# Altium schematic sheet power_5V_3V3_V10.SchDoc
size A4
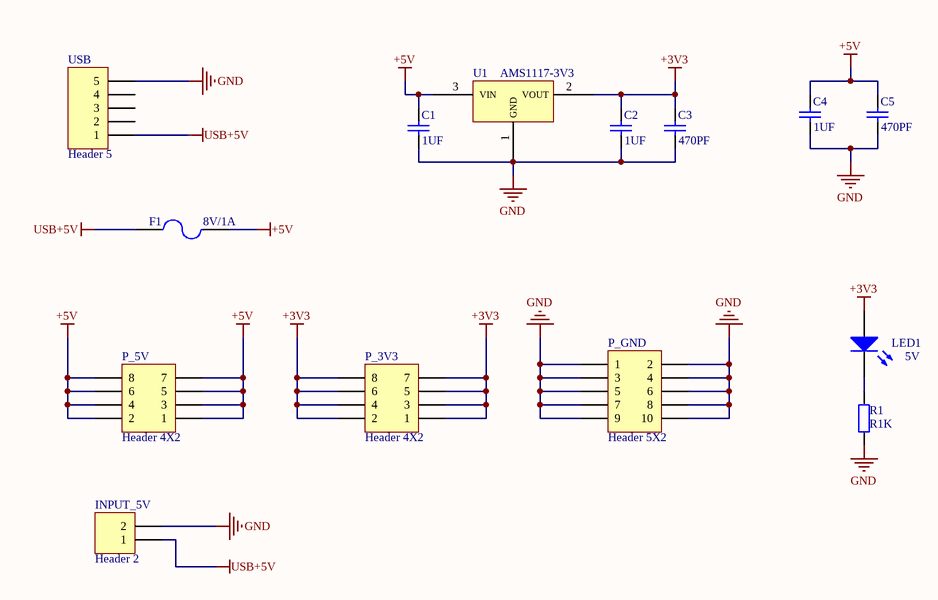
[diagram p0: power_5V_3V3_V10.SchDoc]

## Parts
C1  Cap  [C 0603_M]  (value not drawn)
C2  Cap  [C 0603_M]  (value not drawn)
C3  Cap  [C 0603_M]  (value not drawn)
C4  Cap  [C 0603_M]  (value not drawn)
C5  Cap  [C 0603_M]  (value not drawn)
F1  Fuse 2  [FU 1206]  (value not drawn)
INPUT_5V  Header 2  [HDR2.54-WI-2P]
LED1  5V  [LED 0603Y]
P_3V3  Header 4X2  [HDR2.54-LI-2x4P]
P_5V  Header 4X2  [HDR2.54-LI-2x4P]
P_GND  Header 5X2  [HDR2.54-LI-2x5P]
R1  R1K  [R 0603-HP_M]
U1  AMS1117-3V3  [SOT223_M]
USB  Header 5  [USB-micro_A]

## Nets
+3V3: C2.2 C3.2 LED1.1(A) P_3V3.1 P_3V3.2 P_3V3.3 P_3V3.4 P_3V3.5 P_3V3.6 P_3V3.7 P_3V3.8 U1.2(VOUT)
+5V: C1.2 C4.2 C5.2 F1.2 P_5V.1 P_5V.2 P_5V.3 P_5V.4 P_5V.5 P_5V.6 P_5V.7 P_5V.8 U1.3(VIN)
GND: C1.1 C2.1 C3.1 C4.1 C5.1 INPUT_5V.2 P_GND.1 P_GND.2 P_GND.3 P_GND.4 P_GND.5 P_GND.6 P_GND.7 P_GND.8 P_GND.9 P_GND.10 R1.1 U1.1(GND) USB.5
USB+5V: F1.1 INPUT_5V.1 USB.1
NetLED1_2: LED1.2(K) R1.2

Not connected (* = marked no-connect by the designer): USB 2 3 4

## Notes on the sheet
- (in symbol Cap) 470PF; 1UF
- (in symbol Fuse 2) 8V/1A

## Library data of the parts
C1-C5 = Cap: Capacitor; Published: 8-Jun-2000; LatestRevisionDate: 17-Jul-2002; LatestRevisionNote: Re-released for DXP Platform.; PackageReference: RAD-0.3; Publisher: Altium Limited
F1 = Fuse 2: Fuse; Published: 8-Jun-2000; LatestRevisionDate: 17-Jul-2002; LatestRevisionNote: Re-released for DXP Platform.; PackageReference: PIN-W2/E2.8; Publisher: Altium Limited; PackageDescription: Thru-Hole; 2 Leads
INPUT_5V = Header 2: Header, 2-Pin; LatestRevisionDate: 17-Jul-2002; LatestRevisionNote: Re-released for DXP Platform.; Publisher: Altium Limited
LED1 = LED2: Typical RED, GREEN, YELLOW, AMBER GaAs LED; Published: 8-Jun-2000; LatestRevisionDate: 17-Jul-2002; LatestRevisionNote: Re-released for DXP Platform.; PackageDocument: Feb-2002; PackageReference: 3.2X1.6X1.1; Publisher: Altium Limited
P_3V3 P_5V = Header 4X2: Header, 4-Pin, Dual row; LatestRevisionDate: 17-Jul-2002; LatestRevisionNote: Re-released for DXP Platform.; Publisher: Altium Limited
P_GND = Header 5X2: Header, 5-Pin, Dual row; LatestRevisionDate: 17-Jul-2002; LatestRevisionNote: Re-released for DXP Platform.; Publisher: Altium Limited
R1 = Res2: Resistor; Published: 8-Jun-2000; LatestRevisionDate: 17-Jul-2002; LatestRevisionNote: Re-released for DXP Platform.; PackageReference: AXIAL-0.4; Publisher: Altium Limited
U1 = ASM1117-3V3
USB = Header 5: Header, 5-Pin; LatestRevisionDate: 17-Jul-2002; LatestRevisionNote: Re-released for DXP Platform.; Publisher: Altium Limited